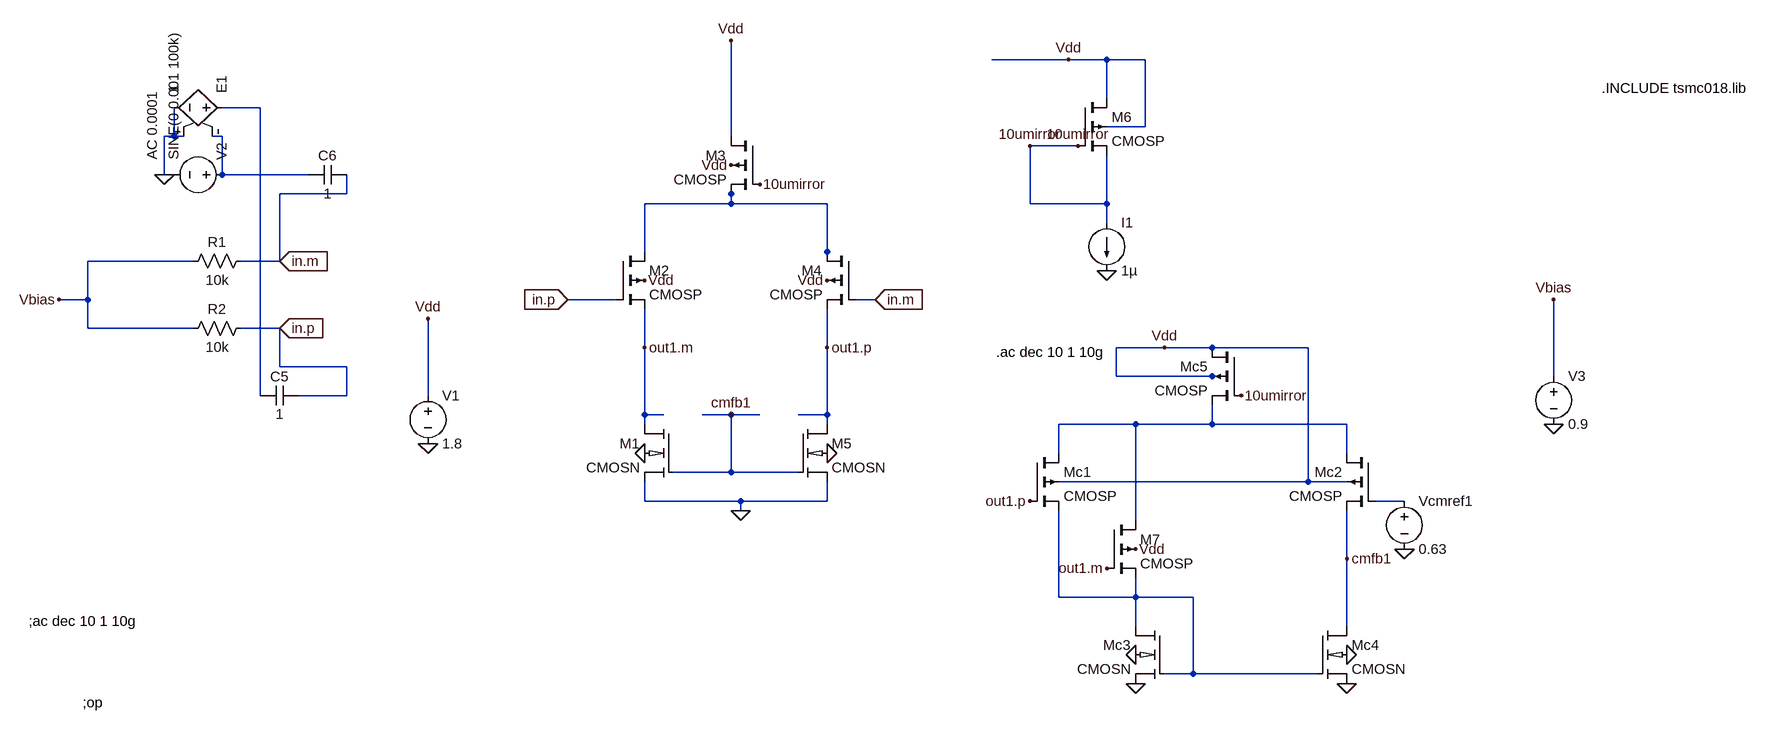
[diagram p0: schematic stage1_rvsited.asc]
stage1_rvsited.asc, the LTspice schematic file:
Version 4
SHEET 1 1856 1248
WIRE 672 -528 544 -528
WIRE 736 -528 672 -528
WIRE 800 -528 736 -528
WIRE 736 -464 736 -528
WIRE -1168 -448 -1232 -448
WIRE 800 -416 800 -528
WIRE 800 -416 736 -416
WIRE -1312 -400 -1312 -448
WIRE -1312 -400 -1328 -400
WIRE -1296 -400 -1312 -400
WIRE -1232 -400 -1248 -400
WIRE 48 -400 48 -560
WIRE 688 -384 608 -384
WIRE -1328 -336 -1328 -400
WIRE -1312 -336 -1328 -336
WIRE -1232 -336 -1232 -400
WIRE -1088 -336 -1232 -336
WIRE -1024 -304 -1024 -336
WIRE -1024 -304 -1136 -304
WIRE 48 -304 48 -320
WIRE 48 -288 48 -304
WIRE 48 -288 -96 -288
WIRE 208 -288 48 -288
WIRE 608 -288 608 -384
WIRE 736 -288 736 -368
WIRE 736 -288 608 -288
WIRE 736 -256 736 -288
WIRE -96 -208 -96 -288
WIRE 208 -208 208 -288
WIRE -1280 -192 -1456 -192
WIRE -1136 -192 -1136 -304
WIRE -1136 -192 -1200 -192
WIRE 208 -192 208 -208
WIRE -1456 -128 -1456 -192
WIRE -1456 -128 -1504 -128
WIRE -144 -128 -224 -128
WIRE 288 -128 256 -128
WIRE -1456 -80 -1456 -128
WIRE -1280 -80 -1456 -80
WIRE -1136 -80 -1200 -80
WIRE -96 -48 -96 -112
WIRE 208 -48 208 -112
WIRE 832 -48 752 -48
WIRE 912 -48 832 -48
WIRE 1072 -48 912 -48
WIRE -1136 -16 -1136 -80
WIRE -1024 -16 -1136 -16
WIRE 752 0 752 -48
WIRE 912 0 752 0
WIRE 928 0 912 0
WIRE 1504 0 1504 -128
WIRE -1168 32 -1168 -448
WIRE -1024 32 -1024 -16
WIRE -1024 32 -1104 32
WIRE -512 32 -512 -96
WIRE -96 64 -96 -48
WIRE -64 64 -96 64
WIRE 48 64 0 64
WIRE 96 64 48 64
WIRE 208 64 208 -48
WIRE 208 64 160 64
WIRE -96 80 -96 64
WIRE 208 80 208 64
WIRE 784 80 656 80
WIRE 912 80 912 48
WIRE 912 80 784 80
WIRE 1136 80 912 80
WIRE 656 128 656 80
WIRE 1136 128 1136 80
WIRE 48 160 48 64
WIRE 48 160 -48 160
WIRE 160 160 48 160
WIRE 1072 176 1072 -48
WIRE 1072 176 656 176
WIRE 1136 176 1072 176
WIRE -96 208 -96 176
WIRE 64 208 -96 208
WIRE 208 208 208 176
WIRE 208 208 64 208
WIRE 1232 208 1184 208
WIRE 64 224 64 208
WIRE 784 240 784 80
WIRE 1136 304 1136 224
WIRE 656 368 656 224
WIRE 784 368 784 336
WIRE 784 368 656 368
WIRE 880 368 784 368
WIRE 784 416 784 368
WIRE 1136 416 1136 304
WIRE 880 496 880 368
WIRE 880 496 832 496
WIRE 1088 496 880 496
FLAG 288 -128 in.m
IOPIN 288 -128 In
FLAG -224 -128 in.p
IOPIN -224 -128 In
FLAG -96 -48 out1.m
FLAG 208 -48 out1.p
FLAG 48 64 cmfb1
FLAG 96 -320 10umirror
FLAG 48 -352 Vdd
FLAG 64 224 0
FLAG 208 128 0
FLAG -96 128 0
FLAG 48 -560 Vdd
FLAG -96 -160 Vdd
FLAG 208 -160 Vdd
FLAG -512 112 0
FLAG -512 -96 Vdd
FLAG -1136 -192 in.m
IOPIN -1136 -192 In
FLAG -1136 -80 in.p
IOPIN -1136 -80 In
FLAG -1504 -128 Vbias
FLAG -1328 -336 0
FLAG 736 -176 0
FLAG 672 -528 Vdd
FLAG 688 -384 10umirror
FLAG 608 -384 10umirror
FLAG 1136 512 0
FLAG 784 512 0
FLAG 1232 288 0
FLAG 784 464 0
FLAG 1136 464 0
FLAG 736 320 out1.m
FLAG 608 208 out1.p
FLAG 1136 304 cmfb1
FLAG 784 288 Vdd
FLAG 832 -48 Vdd
FLAG 960 32 10umirror
FLAG 1504 80 0
FLAG 1504 -128 Vbias
SYMBOL cmosn -48 80 M0
SYMATTR InstName M1
SYMATTR Value2 l=2.4u w=5u
SYMBOL cmosp -144 -208 R0
SYMATTR InstName M2
SYMATTR Value2 l=2.4u w=80u
SYMBOL cmosp 96 -400 M0
SYMATTR InstName M3
SYMATTR Value2 l=2.4u w=160u
SYMBOL cmosp 256 -208 M0
SYMATTR InstName M4
SYMATTR Value2 l=2.4u w=80u
SYMBOL cmosn 160 80 R0
SYMATTR InstName M5
SYMATTR Value2 l=2.4u w=5u
SYMBOL voltage -512 16 R0
WINDOW 123 0 0 Left 0
WINDOW 39 0 0 Left 0
SYMATTR InstName V1
SYMATTR Value 1.8
SYMBOL voltage -1216 -336 M270
WINDOW 123 24 132 Left 0
WINDOW 39 0 0 Left 0
SYMATTR Value2 AC 0.0001
SYMATTR InstName V2
SYMATTR Value SINE(0 0.001 100k)
SYMBOL e2 -1216 -448 M270
SYMATTR InstName E1
SYMATTR Value 1
SYMBOL res -1184 -208 R90
WINDOW 0 0 56 VBottom 0
WINDOW 3 32 56 VTop 0
SYMATTR InstName R1
SYMATTR Value 10k
SYMBOL res -1184 -96 R90
WINDOW 0 0 56 VBottom 0
WINDOW 3 32 56 VTop 0
SYMATTR InstName R2
SYMATTR Value 10k
SYMBOL cap -1104 16 R90
WINDOW 0 0 32 VBottom 0
WINDOW 3 32 32 VTop 0
SYMATTR InstName C5
SYMATTR Value 1
SYMBOL cap -1024 -352 R90
WINDOW 0 0 32 VBottom 0
WINDOW 3 32 32 VTop 0
SYMATTR InstName C6
SYMATTR Value 1
SYMBOL cmosp 688 -464 R0
SYMATTR InstName M6
SYMATTR Value2 l=0.24u w=.64u
SYMBOL current 736 -256 R0
WINDOW 123 0 0 Left 0
WINDOW 39 0 0 Left 0
SYMATTR InstName I1
SYMATTR Value 1µ
SYMBOL cmosp 608 128 R0
SYMATTR InstName Mc1
SYMATTR Value2 l=0.24u w=3.2u
SYMBOL cmosp 736 240 R0
SYMATTR InstName M7
SYMATTR Value2 l=0.24u w=3.2u
SYMBOL cmosp 1184 128 M0
SYMATTR InstName Mc2
SYMATTR Value2 l=0.24u w=6.4u
SYMBOL cmosn 832 416 M0
SYMATTR InstName Mc3
SYMATTR Value2 l=0.24u w=0.4u
SYMBOL cmosn 1088 416 R0
SYMATTR InstName Mc4
SYMATTR Value2 l=0.24u w=0.4u
SYMBOL cmosp 960 -48 M0
SYMATTR InstName Mc5
SYMATTR Value2 l=0.24u w=12.8u
SYMBOL voltage 1232 192 R0
WINDOW 123 0 0 Left 0
WINDOW 39 0 0 Left 0
SYMATTR InstName Vcmref1
SYMATTR Value 0.63
SYMBOL voltage 1504 -16 R0
WINDOW 123 0 0 Left 0
WINDOW 39 0 0 Left 0
SYMATTR InstName V3
SYMATTR Value 0.9
TEXT 552 -40 Left 0 !.ac dec 10 1 10g
TEXT -1554 408 Left 0 !;ac dec 10 1 10g
TEXT 1584 -480 Left 0 !.INCLUDE tsmc018.lib
TEXT -1464 544 Left 0 !;op

The netlist it stands for:
* stage1_rvsited.asc
M1 out1.m cmfb1 0 0 CMOSN l=2.4u w=5u
M2 N003 in.p out1.m Vdd CMOSP l=2.4u w=80u
M3 Vdd 10umirror N003 Vdd CMOSP l=2.4u w=160u
M4 N003 in.m out1.p Vdd CMOSP l=2.4u w=80u
M5 out1.p cmfb1 0 0 CMOSN l=2.4u w=5u
V1 Vdd 0 1.8
V2 N002 0 SINE(0 0.001 100k) AC 0.0001
E1 N001 0 0 N002 1
R1 in.m Vbias 10k
R2 in.p Vbias 10k
C5 in.p N001 1
C6 in.m N002 1
M6 Vdd 10umirror 10umirror Vdd CMOSP l=0.24u w=.64u
I1 10umirror 0 1µ
Mc1 N004 out1.p N006 Vdd CMOSP l=0.24u w=3.2u
M7 N004 out1.m N006 Vdd CMOSP l=0.24u w=3.2u
Mc2 N004 N005 cmfb1 Vdd CMOSP l=0.24u w=6.4u
Mc3 N006 N006 0 0 CMOSN l=0.24u w=0.4u
Mc4 cmfb1 N006 0 0 CMOSN l=0.24u w=0.4u
Mc5 Vdd 10umirror N004 Vdd CMOSP l=0.24u w=12.8u
Vcmref1 N005 0 0.63
V3 Vbias 0 0.9
.model NMOS NMOS
.model PMOS PMOS
.lib standard.mos
.ac dec 10 1 10g
;ac dec 10 1 10g
.INCLUDE tsmc018.lib
;op
.lib tsmc018.lib
.backanno
.end